# Altium schematic sheet 01_MCU.SchDoc
size A3
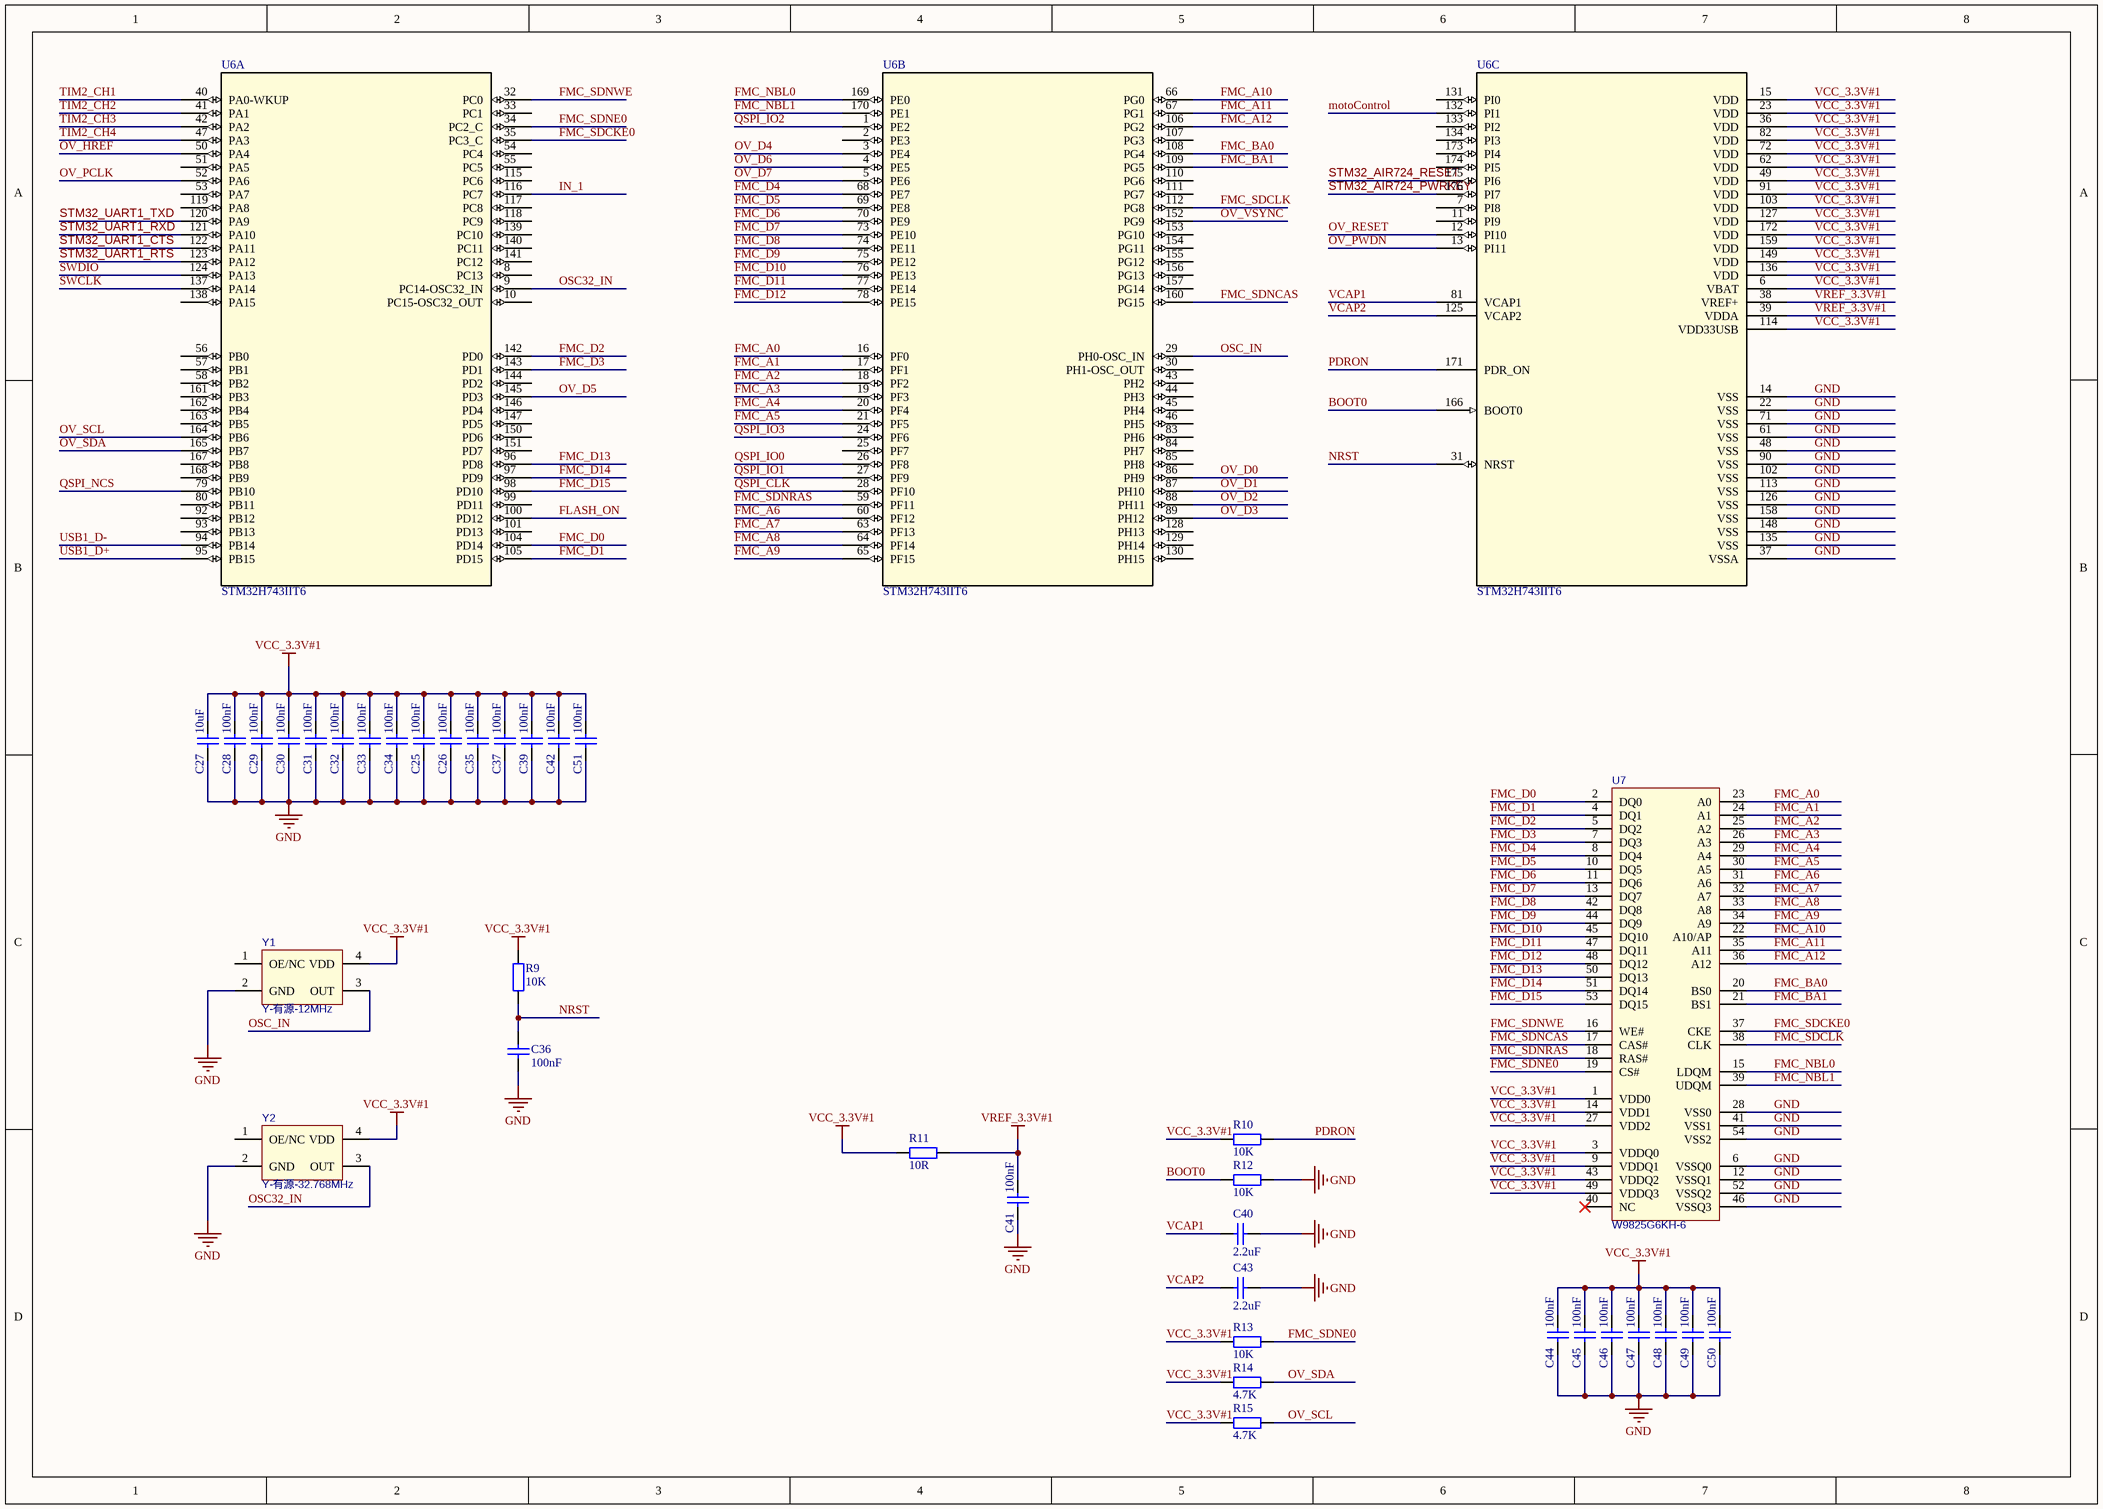
[diagram p0: 01_MCU.SchDoc]

## Parts
C25  100nF  [0603-C]
C26  100nF  [0603-C]
C27  10uF  [0603-C]
C28  100nF  [0603-C]
C29  100nF  [0603-C]
C30  100nF  [0603-C]
C31  100nF  [0603-C]
C32  100nF  [0603-C]
C33  100nF  [0603-C]
C34  100nF  [0603-C]
C35  100nF  [0603-C]
C36  100nF  [0603-C]
C37  100nF  [0603-C]
C39  100nF  [0603-C]
C40  2.2uF  [0603-C]
C41  100nF  [0603-C]
C42  100nF  [0603-C]
C43  2.2uF  [0603-C]
C44  100nF  [0603-C]
C45  100nF  [0603-C]
C46  100nF  [0603-C]
C47  100nF  [0603-C]
C48  100nF  [0603-C]
C49  100nF  [0603-C]
C50  100nF  [0603-C]
C51  100nF  [0603-C]
R9  10K  [0603-R]
R10  10K  [0603-R]
R11  10R  [0603-R]
R12  10K  [0603-R]
R13  10K  [0603-R]
R14  4.7K  [0603-R]
R15  4.7K  [0603-R]
U6  STM32H743IIT6  [LQFP176-24x24mm]  (parts A,B,C of 3)
U7  W9825G6KH-6  [W9825G6KH-6]
Y1  Y-有源-12MHz  [3225]
Y2  Y-有源-32.768MHz  [3225]

## Nets
GND: C25.1 C26.1 C27.1 C28.1 C29.1 C30.1 C31.1 C32.1 C33.1 C34.1 C35.1 C36.1 C37.1 C39.1 C40.2 C41.1 C42.1 C43.2 C44.1 C45.1 C46.1 C47.1 C48.1 C49.1 C50.1 C51.1 R12.1 U6.14(VSS) U6.22(VSS) U6.37(VSSA) U6.48(VSS) U6.61(VSS) U6.71(VSS) U6.90(VSS) U6.102(VSS) U6.113(VSS) U6.126(VSS) U6.135(VSS) U6.148(VSS) U6.158(VSS) U7.6(VSSQ0) U7.12(VSSQ1) U7.28(VSS0) U7.41(VSS1) U7.46(VSSQ3) U7.52(VSSQ2) U7.54(VSS2) Y1.2(GND) Y2.2(GND)
VCC_3.3V#1: C25.2 C26.2 C27.2 C28.2 C29.2 C30.2 C31.2 C32.2 C33.2 C34.2 C35.2 C37.2 C39.2 C42.2 C44.2 C45.2 C46.2 C47.2 C48.2 C49.2 C50.2 C51.2 R9.2 R10.2 R11.2 R13.2 R14.2 R15.2 U6.6(VBAT) U6.15(VDD) U6.23(VDD) U6.36(VDD) U6.49(VDD) U6.62(VDD) U6.72(VDD) U6.82(VDD) U6.91(VDD) U6.103(VDD) U6.114(VDD33USB) U6.127(VDD) U6.136(VDD) U6.149(VDD) U6.159(VDD) U6.172(VDD) U7.1(VDD0) U7.3(VDDQ0) U7.9(VDDQ1) U7.14(VDD1) U7.27(VDD2) U7.43(VDDQ2) U7.49(VDDQ3) Y1.4(VDD) Y2.4(VDD)
VREF_3.3V#1: C41.2 R11.1 U6.38(VREF+) U6.39(VDDA)
BOOT0: R12.2 U6.166(BOOT0)
FLASH_ON: U6.100(PD12)
FMC_A0: U6.16(PF0) U7.23(A0)
FMC_A1: U6.17(PF1) U7.24(A1)
FMC_A2: U6.18(PF2) U7.25(A2)
FMC_A3: U6.19(PF3) U7.26(A3)
FMC_A4: U6.20(PF4) U7.29(A4)
FMC_A5: U6.21(PF5) U7.30(A5)
FMC_A6: U6.60(PF12) U7.31(A6)
FMC_A7: U6.63(PF13) U7.32(A7)
FMC_A8: U6.64(PF14) U7.33(A8)
FMC_A9: U6.65(PF15) U7.34(A9)
FMC_A10: U6.66(PG0) U7.22(A10/AP)
FMC_A11: U6.67(PG1) U7.35(A11)
FMC_A12: U6.106(PG2) U7.36(A12)
FMC_BA0: U6.108(PG4) U7.20(BS0)
FMC_BA1: U6.109(PG5) U7.21(BS1)
FMC_D0: U6.104(PD14) U7.2(DQ0)
FMC_D1: U6.105(PD15) U7.4(DQ1)
FMC_D2: U6.142(PD0) U7.5(DQ2)
FMC_D3: U6.143(PD1) U7.7(DQ3)
FMC_D4: U6.68(PE7) U7.8(DQ4)
FMC_D5: U6.69(PE8) U7.10(DQ5)
FMC_D6: U6.70(PE9) U7.11(DQ6)
FMC_D7: U6.73(PE10) U7.13(DQ7)
FMC_D8: U6.74(PE11) U7.42(DQ8)
FMC_D9: U6.75(PE12) U7.44(DQ9)
FMC_D10: U6.76(PE13) U7.45(DQ10)
FMC_D11: U6.77(PE14) U7.47(DQ11)
FMC_D12: U6.78(PE15) U7.48(DQ12)
FMC_D13: U6.96(PD8) U7.50(DQ13)
FMC_D14: U6.97(PD9) U7.51(DQ14)
FMC_D15: U6.98(PD10) U7.53(DQ15)
FMC_NBL0: U6.169(PE0) U7.15(LDQM)
FMC_NBL1: U6.170(PE1) U7.39(UDQM)
FMC_SDCKE0: U6.35(PC3_C) U7.37(CKE)
FMC_SDCLK: U6.112(PG8) U7.38(CLK)
FMC_SDNCAS: U6.160(PG15) U7.17(CAS#)
FMC_SDNE0: R13.1 U6.34(PC2_C) U7.19(CS#)
FMC_SDNRAS: U6.59(PF11) U7.18(RAS#)
FMC_SDNWE: U6.32(PC0) U7.16(WE#)
IN_1: U6.116(PC7)
motoControl: U6.132(PI1)
NRST: C36.2 R9.1 U6.31(NRST)
OSC32_IN: U6.9(PC14-OSC32_IN) Y2.3(OUT)
OSC_IN: U6.29(PH0-OSC_IN) Y1.3(OUT)
OV_D0: U6.86(PH9)
OV_D1: U6.87(PH10)
OV_D2: U6.88(PH11)
OV_D3: U6.89(PH12)
OV_D4: U6.3(PE4)
OV_D5: U6.145(PD3)
OV_D6: U6.4(PE5)
OV_D7: U6.5(PE6)
OV_HREF: U6.50(PA4)
OV_PCLK: U6.52(PA6)
OV_PWDN: U6.13(PI11)
OV_RESET: U6.12(PI10)
OV_SCL: R15.1 U6.164(PB6)
OV_SDA: R14.1 U6.165(PB7)
OV_VSYNC: U6.152(PG9)
PDRON: R10.1 U6.171(PDR_ON)
QSPI_CLK: U6.28(PF10)
QSPI_IO0: U6.26(PF8)
QSPI_IO1: U6.27(PF9)
QSPI_IO2: U6.1(PE2)
QSPI_IO3: U6.24(PF6)
QSPI_NCS: U6.79(PB10)
STM32_AIR724_PWRKEY: U6.176(PI7)
STM32_AIR724_RESET: U6.175(PI6)
STM32_UART1_CTS: U6.122(PA11)
STM32_UART1_RTS: U6.123(PA12)
STM32_UART1_RXD: U6.121(PA10)
STM32_UART1_TXD: U6.120(PA9)
SWCLK: U6.137(PA14)
SWDIO: U6.124(PA13)
TIM2_CH1: U6.40(PA0-WKUP)
TIM2_CH2: U6.41(PA1)
TIM2_CH3: U6.42(PA2)
TIM2_CH4: U6.47(PA3)
USB1_D+: U6.95(PB15)
USB1_D-: U6.94(PB14)
VCAP1: C40.1 U6.81(VCAP1)
VCAP2: C43.1 U6.125(VCAP2)

Not connected (* = marked no-connect by the designer): U6 2(PE3) 7(PI8) 8(PC13) 10(PC15-OSC32_OUT) 11(PI9) 25(PF7) 30(PH1-OSC_OUT) 33(PC1) 43(PH2) 44(PH3) 45(PH4) 46(PH5) 51(PA5) 53(PA7) 54(PC4) 55(PC5) 56(PB0) 57(PB1) 58(PB2) 80(PB11) 83(PH6) 84(PH7) 85(PH8) 92(PB12) 93(PB13) 99(PD11) 101(PD13) 107(PG3) 110(PG6) 111(PG7) 115(PC6) 117(PC8) 118(PC9) 119(PA8) 128(PH13) 129(PH14) 130(PH15) 131(PI0) 133(PI2) 134(PI3) 138(PA15) 139(PC10) 140(PC11) 141(PC12) 144(PD2) 146(PD4) 147(PD5) 150(PD6) 151(PD7) 153(PG10) 154(PG11) 155(PG12) 156(PG13) 157(PG14) 161(PB3) 162(PB4) 163(PB5) 167(PB8) 168(PB9) 173(PI4) 174(PI5); U7 40(NC)*; Y1 1(OE/NC); Y2 1(OE/NC)

## Library data of the parts
C25-C37 C39-C51 = C: 贴片电容; BOM名称: 无极性贴片电容; 联系卖家，免费查找封装: 唯一出售店铺网址https://shop463601444.taobao.com
R9-R15 = R: 贴片电阻; 联系卖家，免费查找封装: 唯一出售店铺网址https://shop463601444.taobao.com; BOM名称: 贴片电阻
U6 = STM32H743IIT6: No Description Available; Mfr_Name: STMicroelectronics; Copyright: Copyright (C) 2023 Ultra Librarian. All rights reserved.; Manufacturer_Part_Number: STM32H743IIT6; RefDes: RefDes; Type: DEV
U7 = W9825G6KH-6: BOM_Manufacturer: WINBOND; BOM_Supplier: LCSC; BOM_Manufacturer Part: W9825G6KH-6; BOM_Supplier Part: C62246; BOM_JLCPCB Part Class: Extended Part; spicePre: U; spiceSymbolName: W9825G6KH-6
Y1 Y2 = Y-有源: 有源晶振; BOM_Manufacturer: YXC扬兴科技; BOM_Manufacturer Part: OT322540MJBA4SL; nameAlias: Frequency; Contributor: LCSC; BOM_Supplier: LCSC; BOM_Supplier Part: C2831396; BOM_JLCPCB Part Class: Extended Part; spicePre: X; spiceSymbolName: OT322540MJBA4SL